# EAGLE design hijack_jtag_a (EAGLE 6.2)
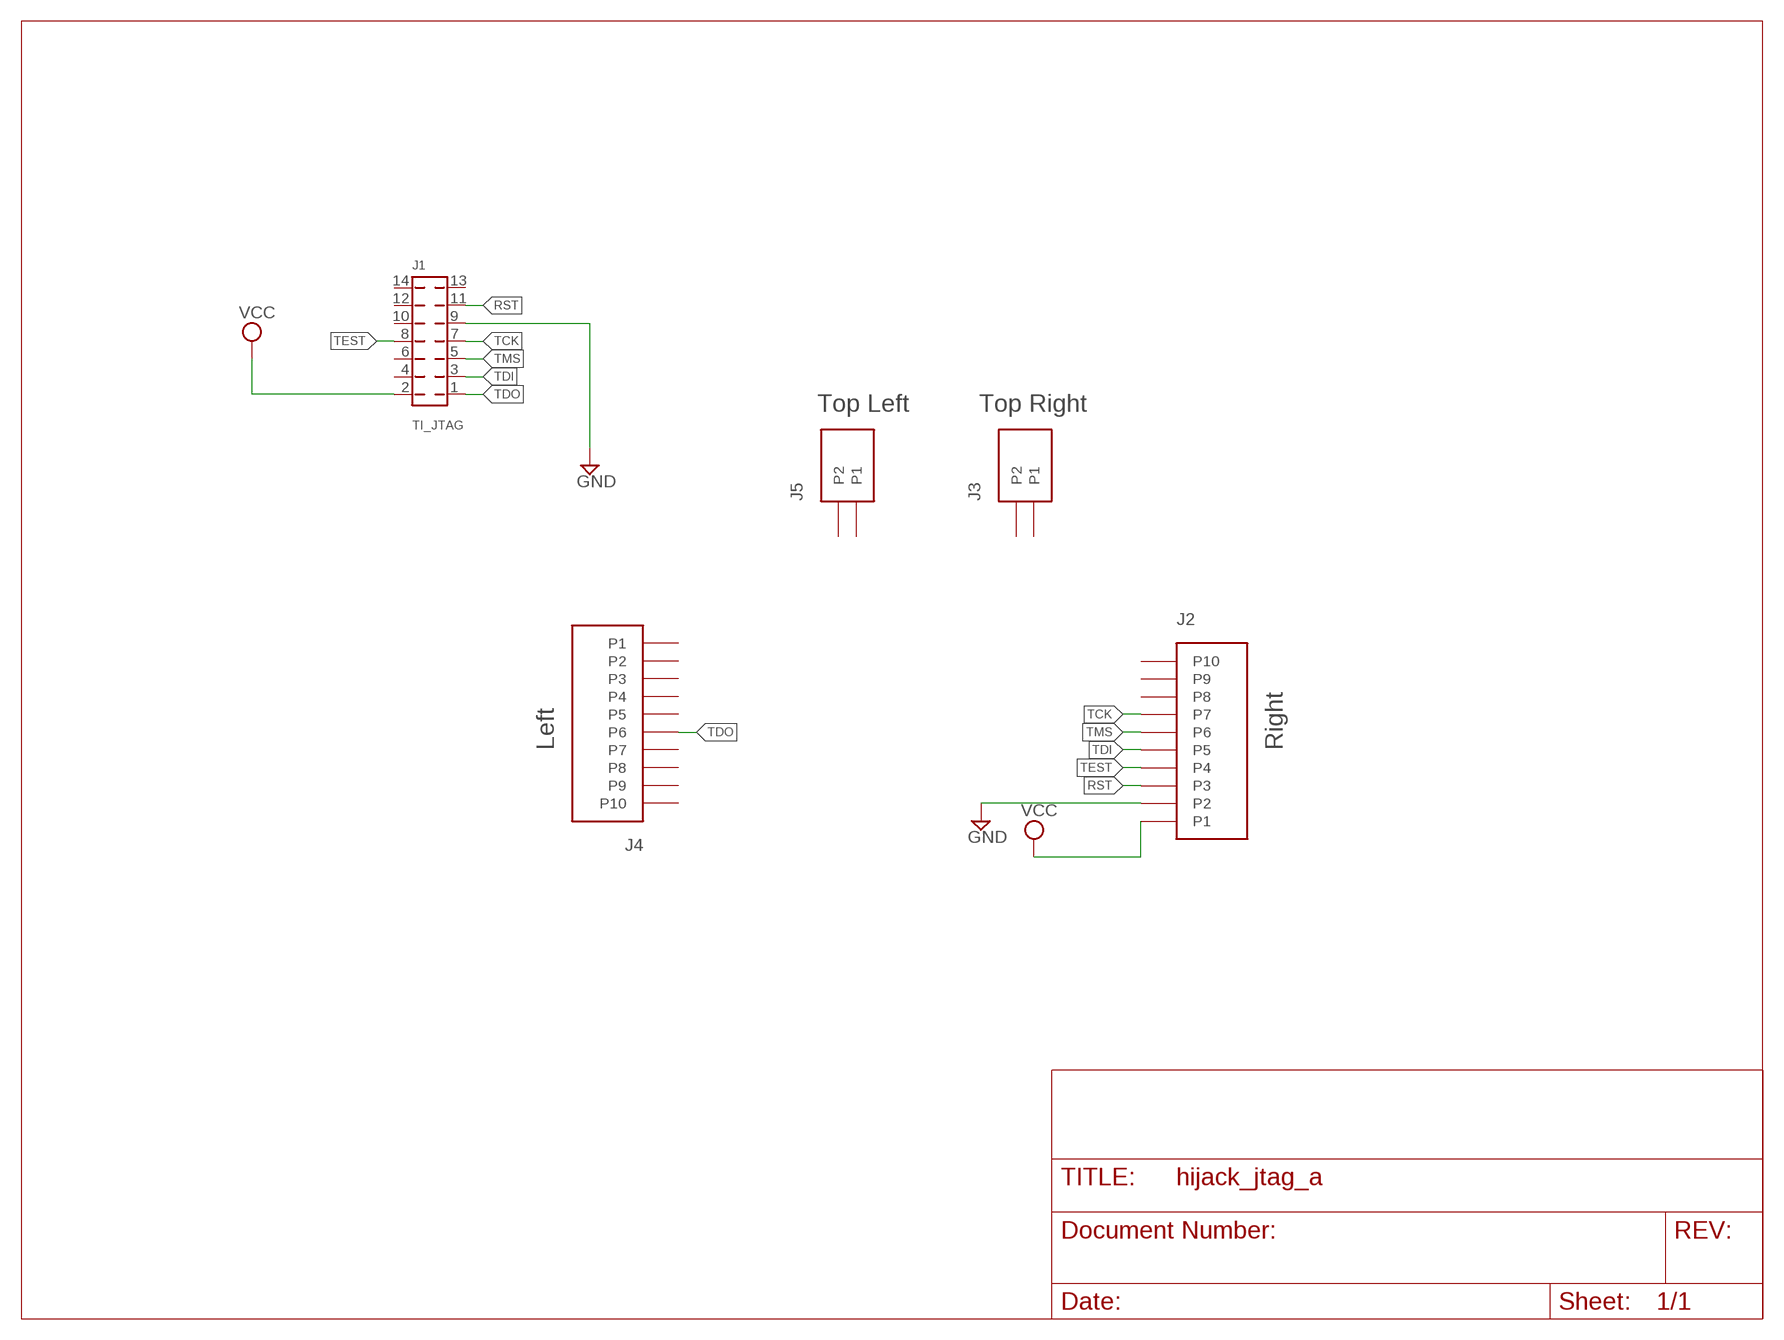
[diagram p0: schematic, sheet 1]

## Parts
J1  TI_JTAG  [TST-107]
J2  HEADER10POS  [10PIN2MMHEADER]
J3  HEADER2POS  [2PIN2MMHEADER]
J4  HEADER10POS  [10PIN2MMHEADER]
J5  HEADER2POS  [2PIN2MMHEADER]

## Nets
GND [power]: J1.9 J2.P2
RST: J1.11 J2.P3
TCK: J1.7 J2.P7
TDI: J1.3 J2.P5
TDO: J1.1 J4.P6
TEST: J1.8 J2.P4
TMS: J1.5 J2.P6
VCC: J1.2 J2.P1
Unconnected: J1.4 J1.6 J1.10 J1.12 J1.13 J1.14 J2.P8 J2.P9 J2.P10 J3.P1 J3.P2 J4.P1 J4.P2 J4.P3 J4.P4 J4.P5 J4.P7 J4.P8 J4.P9 J4.P10 J5.P1 J5.P2

## Notes on the sheet
- Top Left | Top Right
- Left | Right

## Library data of the parts
J1 = hijack:TI_JTAG
J2 J4 = hijack:HEADER10POS: Fits 3M 950510-6102-AR
J3 J5 = hijack:HEADER2POS

## Net classes
1 power: width 0.635 mm, clearance 0.406 mm

## Board
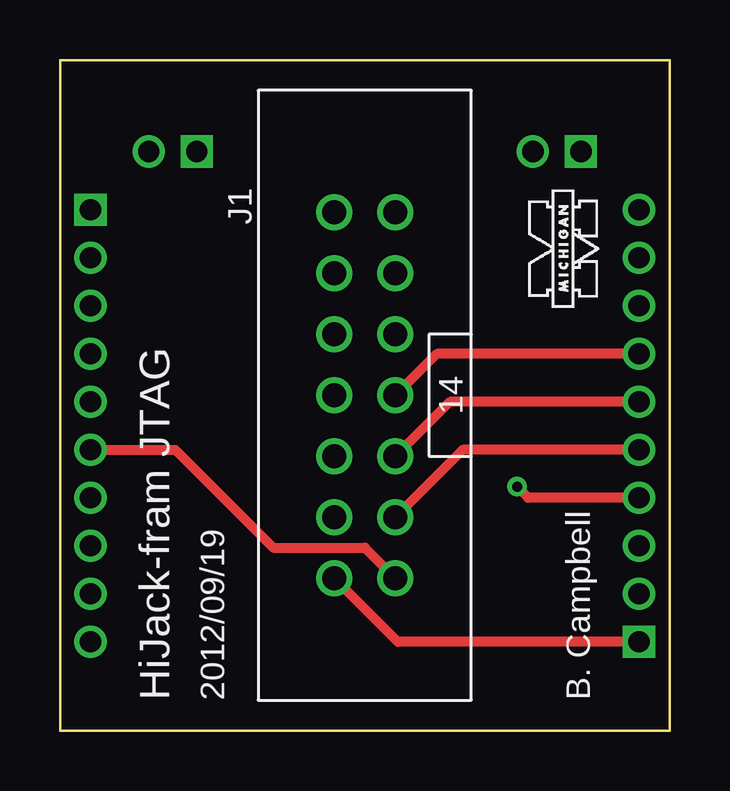
[diagram p1: board, top side]
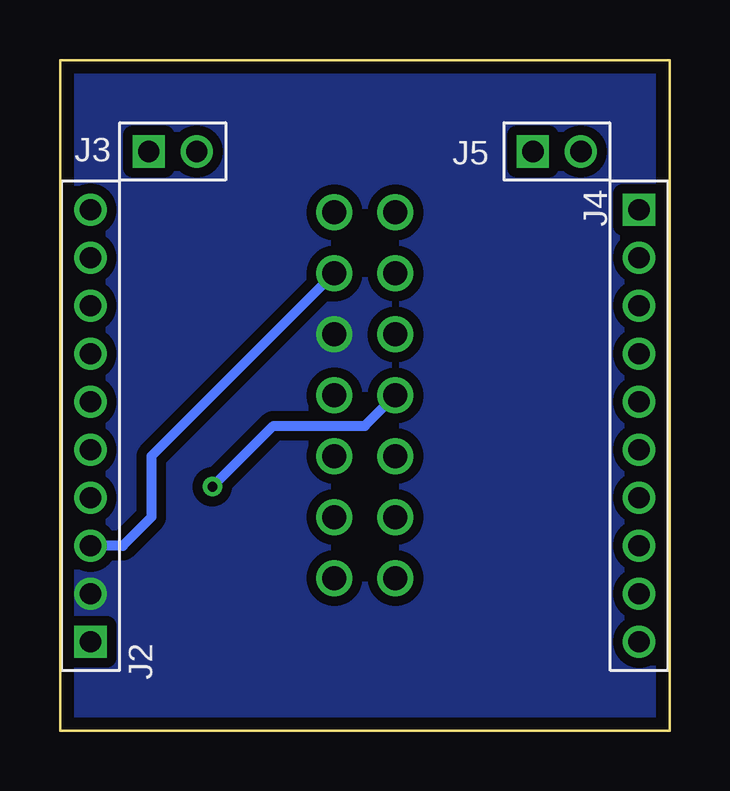
[diagram p2: board, bottom side, seen from below]

Size 25.4 x 27.94 mm. Coordinates in mm from the lower left corner, seen from the top.
Outline: 0,0 0,27.94 25.4,27.94 25.4,0 0,0
Copper layers (1*16): Top 0.0178mm / dielectric 59mil / Bottom 0.0178mm
Design rules: minimum track width 6mil, minimum drill 14mil, track to track 6mil, track to pad 6mil, pad to pad 6mil, via to via 6mil, smd to smd 6mil, copper to edge 20mil, drill to drill 16mil, minimum pad ring 8mil, minimum via ring 8mil, stop-mask expansion 3mil, vias tented up to drill 16mil, thermal gap 16mil

### Footprints (pad centres in the part's own frame; a part is rotated, then mirrored left to right if it is on the bottom)
TST-107 = drill 1: 1 7.62,1.27; 2 7.62,-1.27; 3 5.08,1.27; 4 5.08,-1.27; 5 2.54,1.27; 6 2.54,-1.27; 7 0,1.27; 8 0,-1.27; 9 -2.54,1.27; 10 -2.54,-1.27; 11 -5.08,1.27; 12 -5.08,-1.27; 13 -7.62,1.27; 14 -7.62,-1.27
10PIN2MMHEADER = drill 0.89 pad 1.346 square: P1 -9,0 | drill 0.89 pad 1.346: P2 -7,0; P3 -5,0; P4 -3,0; P5 -1,0; P6 1,0; P7 3,0; P8 5,0; P9 7,0; P10 9,0
2PIN2MMHEADER = drill 0.89 pad 1.346 square: P1 -1,0 | drill 0.89 pad 1.346: P2 1,0

### Placement (x,y rotation side)
J1  12.7,13.97 270 top
J2  24.13,12.7 90 bottom
J3  20.7,24.13 0 bottom
J4  1.27,12.7 270 bottom
J5  4.7,24.13 0 bottom
U$1  [UMICH]  22.63,17.55 90 top

### Tracks (layer width: path | path; a pad name or v marks a point on that pad's centre or on a via)
GND
  pour Bottom (isolate 0.25, no thermals): 25.4,27.94 25.4,0 0,0 0,27.94
RST
  Bottom 0.406: J1.11 21.59,11.43 21.59,8.89 22.78,7.7 J2.P3
TCK
  Top 0.406: J2.P7 15.7,15.7 J1.7
TDI
  Top 0.406: J2.P5 16.78,11.7 J1.3
TDO
  Top 0.406: J4.P6 4.81,11.7 8.89,7.62 12.7,7.62 J1.1
TEST  (via drill 0.41)
  Top 0.406: J2.P4 19.51,9.7 v19.05,10.16
  Bottom 0.406: v19.05,10.16 16.51,12.7 12.7,12.7 J1.8
TMS
  Top 0.406: J2.P6 16.24,13.7 J1.5
VCC
  Top 0.406: J2.P1 14.08,3.7 J1.2

### Text on the board
tPlace: HiJack-fram JTAG | 2012/09/19 | B. Campbell